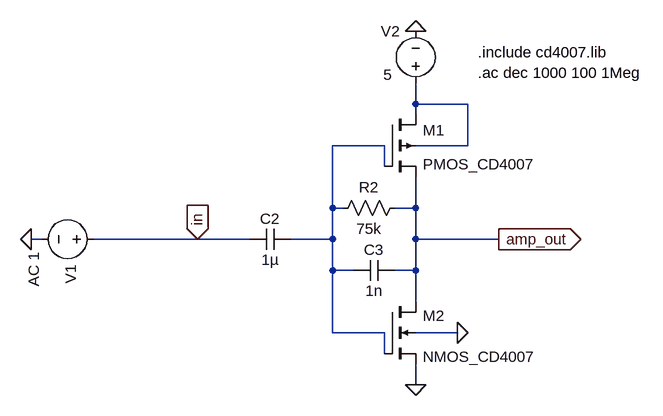
[diagram p0: schematic Amplifier.asc]
Amplifier.asc, the LTspice schematic file:
Version 4.1
SHEET 1 908 680
WIRE 528 -32 528 -64
WIRE 608 -32 528 -32
WIRE 528 -16 528 -32
WIRE 480 32 400 32
WIRE 608 32 608 -32
WIRE 608 32 528 32
WIRE 480 64 480 32
WIRE 400 128 400 32
WIRE 416 128 400 128
WIRE 528 128 528 80
WIRE 528 128 496 128
WIRE -48 176 -64 176
WIRE 192 176 32 176
WIRE 272 176 192 176
WIRE 400 176 400 128
WIRE 400 176 336 176
WIRE 528 176 528 128
WIRE 656 176 528 176
WIRE 400 224 400 176
WIRE 432 224 400 224
WIRE 528 224 528 176
WIRE 528 224 496 224
WIRE 528 272 528 224
WIRE 400 320 400 224
WIRE 480 320 400 320
WIRE 592 320 528 320
WIRE 480 352 480 320
WIRE 528 400 528 368
FLAG -64 176 0
FLAG 592 320 0
FLAG 528 400 0
FLAG 656 176 amp_out
IOPIN 656 176 Out
FLAG 528 -144 0
FLAG 192 176 in
IOPIN 192 176 In
SYMBOL voltage 48 176 R90
WINDOW 0 39 51 Left 2
WINDOW 3 20 108 Left 2
WINDOW 123 0 0 Left 0
WINDOW 39 0 0 Left 0
SYMATTR InstName V1
SYMATTR Value AC 1
SYMBOL nmos4 480 272 R0
WINDOW 3 59 85 Left 2
WINDOW 0 59 22 Left 2
SYMATTR Value NMOS_CD4007
SYMATTR InstName M2
SYMATTR Value2 L=5u W=170u Ad=8500p As=8500p Pd=440u Ps=440u NRD=0.1 NRS=0.1
SYMBOL pmos4 480 -16 R0
WINDOW 3 59 77 Left 2
WINDOW 0 59 24 Left 2
SYMATTR Value PMOS_CD4007
SYMATTR InstName M1
SYMATTR Value2 L=5u W=360u Ad=18000p As=18000p Pd=820u Ps=820u NRS=0.54 NRD=0.54
SYMBOL voltage 528 -48 R180
WINDOW 0 24 96 Left 2
WINDOW 3 36 29 Left 2
SYMATTR InstName V2
SYMATTR Value 5
SYMBOL res 512 112 R90
WINDOW 0 0 56 VBottom 2
WINDOW 3 32 56 VTop 2
SYMATTR InstName R2
SYMATTR Value 75k
SYMBOL cap 496 208 R90
WINDOW 0 0 32 VBottom 2
WINDOW 3 32 32 VTop 2
SYMATTR InstName C3
SYMATTR Value 1n
SYMBOL cap 336 160 R90
WINDOW 0 0 32 VBottom 2
WINDOW 3 32 32 VTop 2
SYMATTR InstName C2
SYMATTR Value 1µ
TEXT 624 -80 Left 2 !.ac dec 1000 100 1Meg
TEXT 624 -112 Left 2 !.include cd4007.lib

The netlist it stands for:
* Amplifier.asc
V1 in 0 AC 1
M2 amp_out N002 0 0 NMOS_CD4007 L=5u W=170u Ad=8500p As=8500p Pd=440u Ps=440u NRD=0.1 NRS=0.1
M1 N001 N002 amp_out N001 PMOS_CD4007 L=5u W=360u Ad=18000p As=18000p Pd=820u Ps=820u NRS=0.54 NRD=0.54
V2 N001 0 5
R2 amp_out N002 75k
C3 amp_out N002 1n
C2 N002 in 1µ
.model NMOS NMOS
.model PMOS PMOS
.lib standard.mos
.ac dec 1000 100 1Meg
.include cd4007.lib
.backanno
.end